# Altium schematic sheet RS232 - USB.SchDoc
size A4
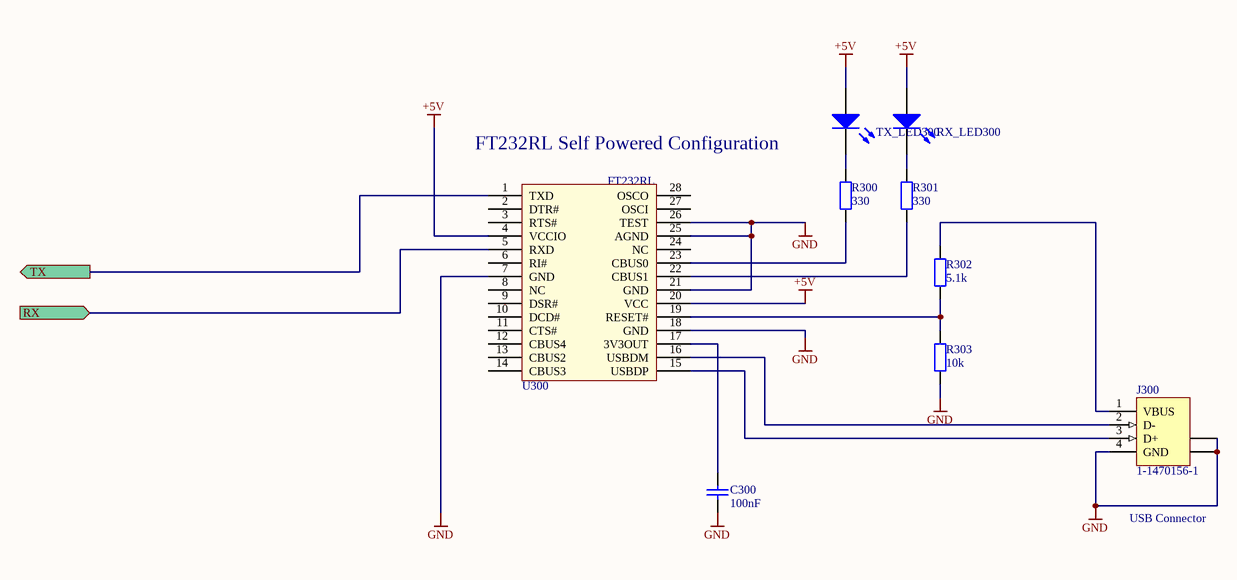
[diagram p0: RS232 - USB.SchDoc]

## Parts
C300  value 100nF  [3216[1206]]  (hidden comment: Cap)
J300  1-1470156-1  [USB2.5-2H4D]
R300  value 330  [3216[1206]]  (hidden comment: Resistor)
R301  value 330  [3216[1206]]  (hidden comment: Resistor)
R302  value 5.1k  [3216[1206]]  (hidden comment: Resistor)
R303  value 10k  [3216[1206]]  (hidden comment: Resistor)
RX_LED300  LED  [LED_1206]  (value not drawn)
TX_LED300  LED  [LED_1206]  (value not drawn)
U300  FT232RL  [SSOP28]

## Ports
RX (in), TX (out)

## Nets
+5V: RX_LED300.A TX_LED300.A U300.4(VCCIO) U300.20(VCC)
GND: C300.1 J300.4(GND) J300.5(SHLD) J300.6(SHLD) R303.1 U300.7(GND) U300.18(GND) U300.21(GND) U300.25(AGND) U300.26(TEST)
RX: U300.5(RXD) ; port RX
TX: U300.1(TXD) ; port TX
NetC300_2: C300.2 U300.17(3V3OUT)
NetJ300_1: J300.1(VBUS) R302.2
NetJ300_2: J300.2(D-) U300.16(USBDM)
NetJ300_3: J300.3(D+) U300.15(USBDP)
NetR300_1: R300.1 U300.23(CBUS0)
NetR300_2: R300.2 TX_LED300.K
NetR301_1: R301.1 U300.22(CBUS1)
NetR301_2: R301.2 RX_LED300.K
NetR302_1: R302.1 R303.2 U300.19(RESET#)

Not connected (* = marked no-connect by the designer): U300 2(DTR#) 3(RTS#) 6(RI#) 8(NC) 9(DSR#) 10(DCD#) 11(CTS#) 12(CBUS4) 13(CBUS2) 14(CBUS3) 24(NC) 27(OSCI) 28(OSCO)

## Notes on the sheet
- FT232RL Self Powered Configuration
- USB Connector

## Library data of the parts
J300 = 1-1470156-1: USB 1.1, Right Angle, Thru-Hole, B Type, Receptacle, 4 Position, White; ContactMaterial: Phosphor Bronze; ContactPlating: Gold over Nickel; TerminationLength: 3.00mm [0.118in.]; PCB_Layout: Complies with manufacturer's recommendation.; DrillSize: Corresponds to nominal value.; PanelGround: Without; Published: 15-Jul-2004; DatasheetDocument: 02-Jun-2001; PackageDocument: 02-Jun-2001; PackageReference: 1-1470156; Publisher: Altium Limited; HousingMaterial: Glass-Filled Thermoplastic; ComponentLink1Description: Manufacturer Link; ComponentLink1URL: http://www.tycoelectronics.com/; ComponentLink2Description: Packaging Specification; ComponentLink2URL: http://ecommas.tycoelectronics.com/commerce/DocumentDelivery/DDEController?Action=showdoc&DocId=Customer+Drawing%7F1470156%7FO%7Ftif%7FEnglish%7FC_1470156_O.tif
R300-R303 = RES1
RX_LED300 TX_LED300 = LED: Value: TBD
U300 = FT232RL: Value: FT232RL